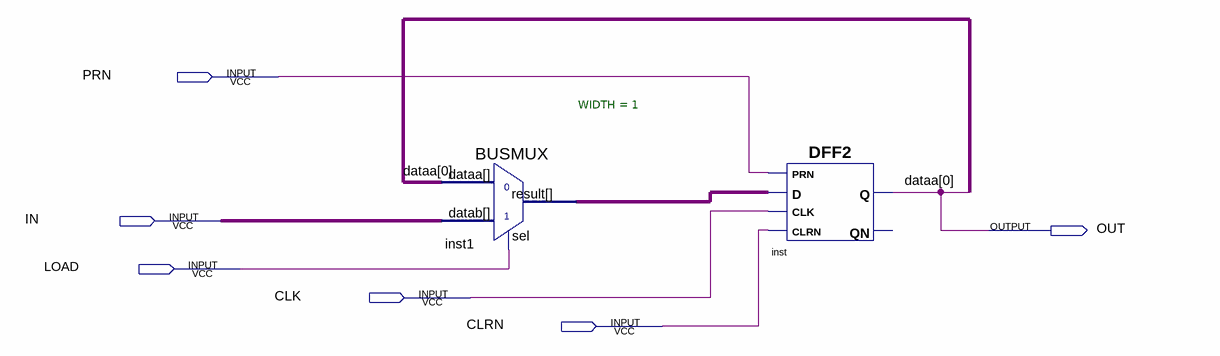
[diagram p0: schematic sheet]
// Quartus schematic register.bdf as structural Verilog: 2 symbols, 6 pins
module register (
  input  PRN,
  input  IN,
  input  LOAD,
  input  CLK,
  input  CLRN,
  output OUT
);

  wire inst1_result;

  BUSMUX #(.WIDTH(1)) inst1 (.datab(IN), .sel(LOAD), .dataa(OUT), .result(inst1_result));
  DFF2 inst (.CLK(CLK), .D(inst1_result), .PRN(PRN), .CLRN(CLRN), .Q(OUT));  // open: QN

  // Other names for the same wires on the sheet: dataa[0] = OUT
endmodule
